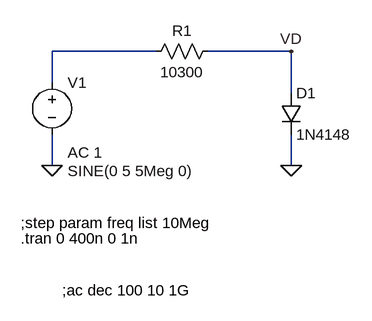
[diagram p0: schematic 1n4148-freq-sim.asc]
1n4148-freq-sim.asc, the LTspice schematic file:
Version 4
SHEET 1 880 680
WIRE 48 64 -112 64
WIRE 256 64 128 64
WIRE -112 112 -112 64
WIRE 256 128 256 64
WIRE -112 240 -112 192
WIRE 256 240 256 192
FLAG -112 240 0
FLAG 256 240 0
FLAG 256 64 VD
SYMBOL diode 240 128 R0
SYMATTR InstName D1
SYMATTR Value 1N4148
SYMBOL res 144 48 R90
WINDOW 0 0 56 VBottom 2
WINDOW 3 32 56 VTop 2
SYMATTR InstName R1
SYMATTR Value 10300
SYMBOL voltage -112 96 R0
WINDOW 123 24 124 Left 2
WINDOW 39 0 0 Left 0
WINDOW 3 24 152 Left 2
SYMATTR Value2 AC 1
SYMATTR Value SINE(0 5 5Meg 0)
SYMATTR InstName V1
TEXT -160 328 Left 2 !;step param freq list 10Meg
TEXT -160 352 Left 2 !.tran 0 400n 0 1n
TEXT -96 432 Left 2 !;ac dec 100 10 1G

The netlist it stands for:
* 1n4148-freq-sim.asc
D1 VD 0 1N4148
R1 VD N001 10300
V1 N001 0 SINE(0 5 5Meg 0) AC 1
.model D D
.lib standard.dio
;step param freq list 10Meg
.tran 0 400n 0 1n
;ac dec 100 10 1G
.backanno
.end